# Altium schematic sheet Beacon.SchDoc
size A3; PageSetup: Record=PageOptions|CenterHorizontal=True|CenterVertical=True|PrintScale=0.97|XCorrection=1.00|YCorrection=1.00|PrintKind=0|BorderSize=5000000|LeftOffset=0|BottomOffset=0|Orientation=2|PaperLength=1000|PaperWidth=1000|Scale=100|PaperSource=7|PrintQuality=-4|MediaType=1|DitherType=10|PaperKind=A4|PrintScaleMode=1
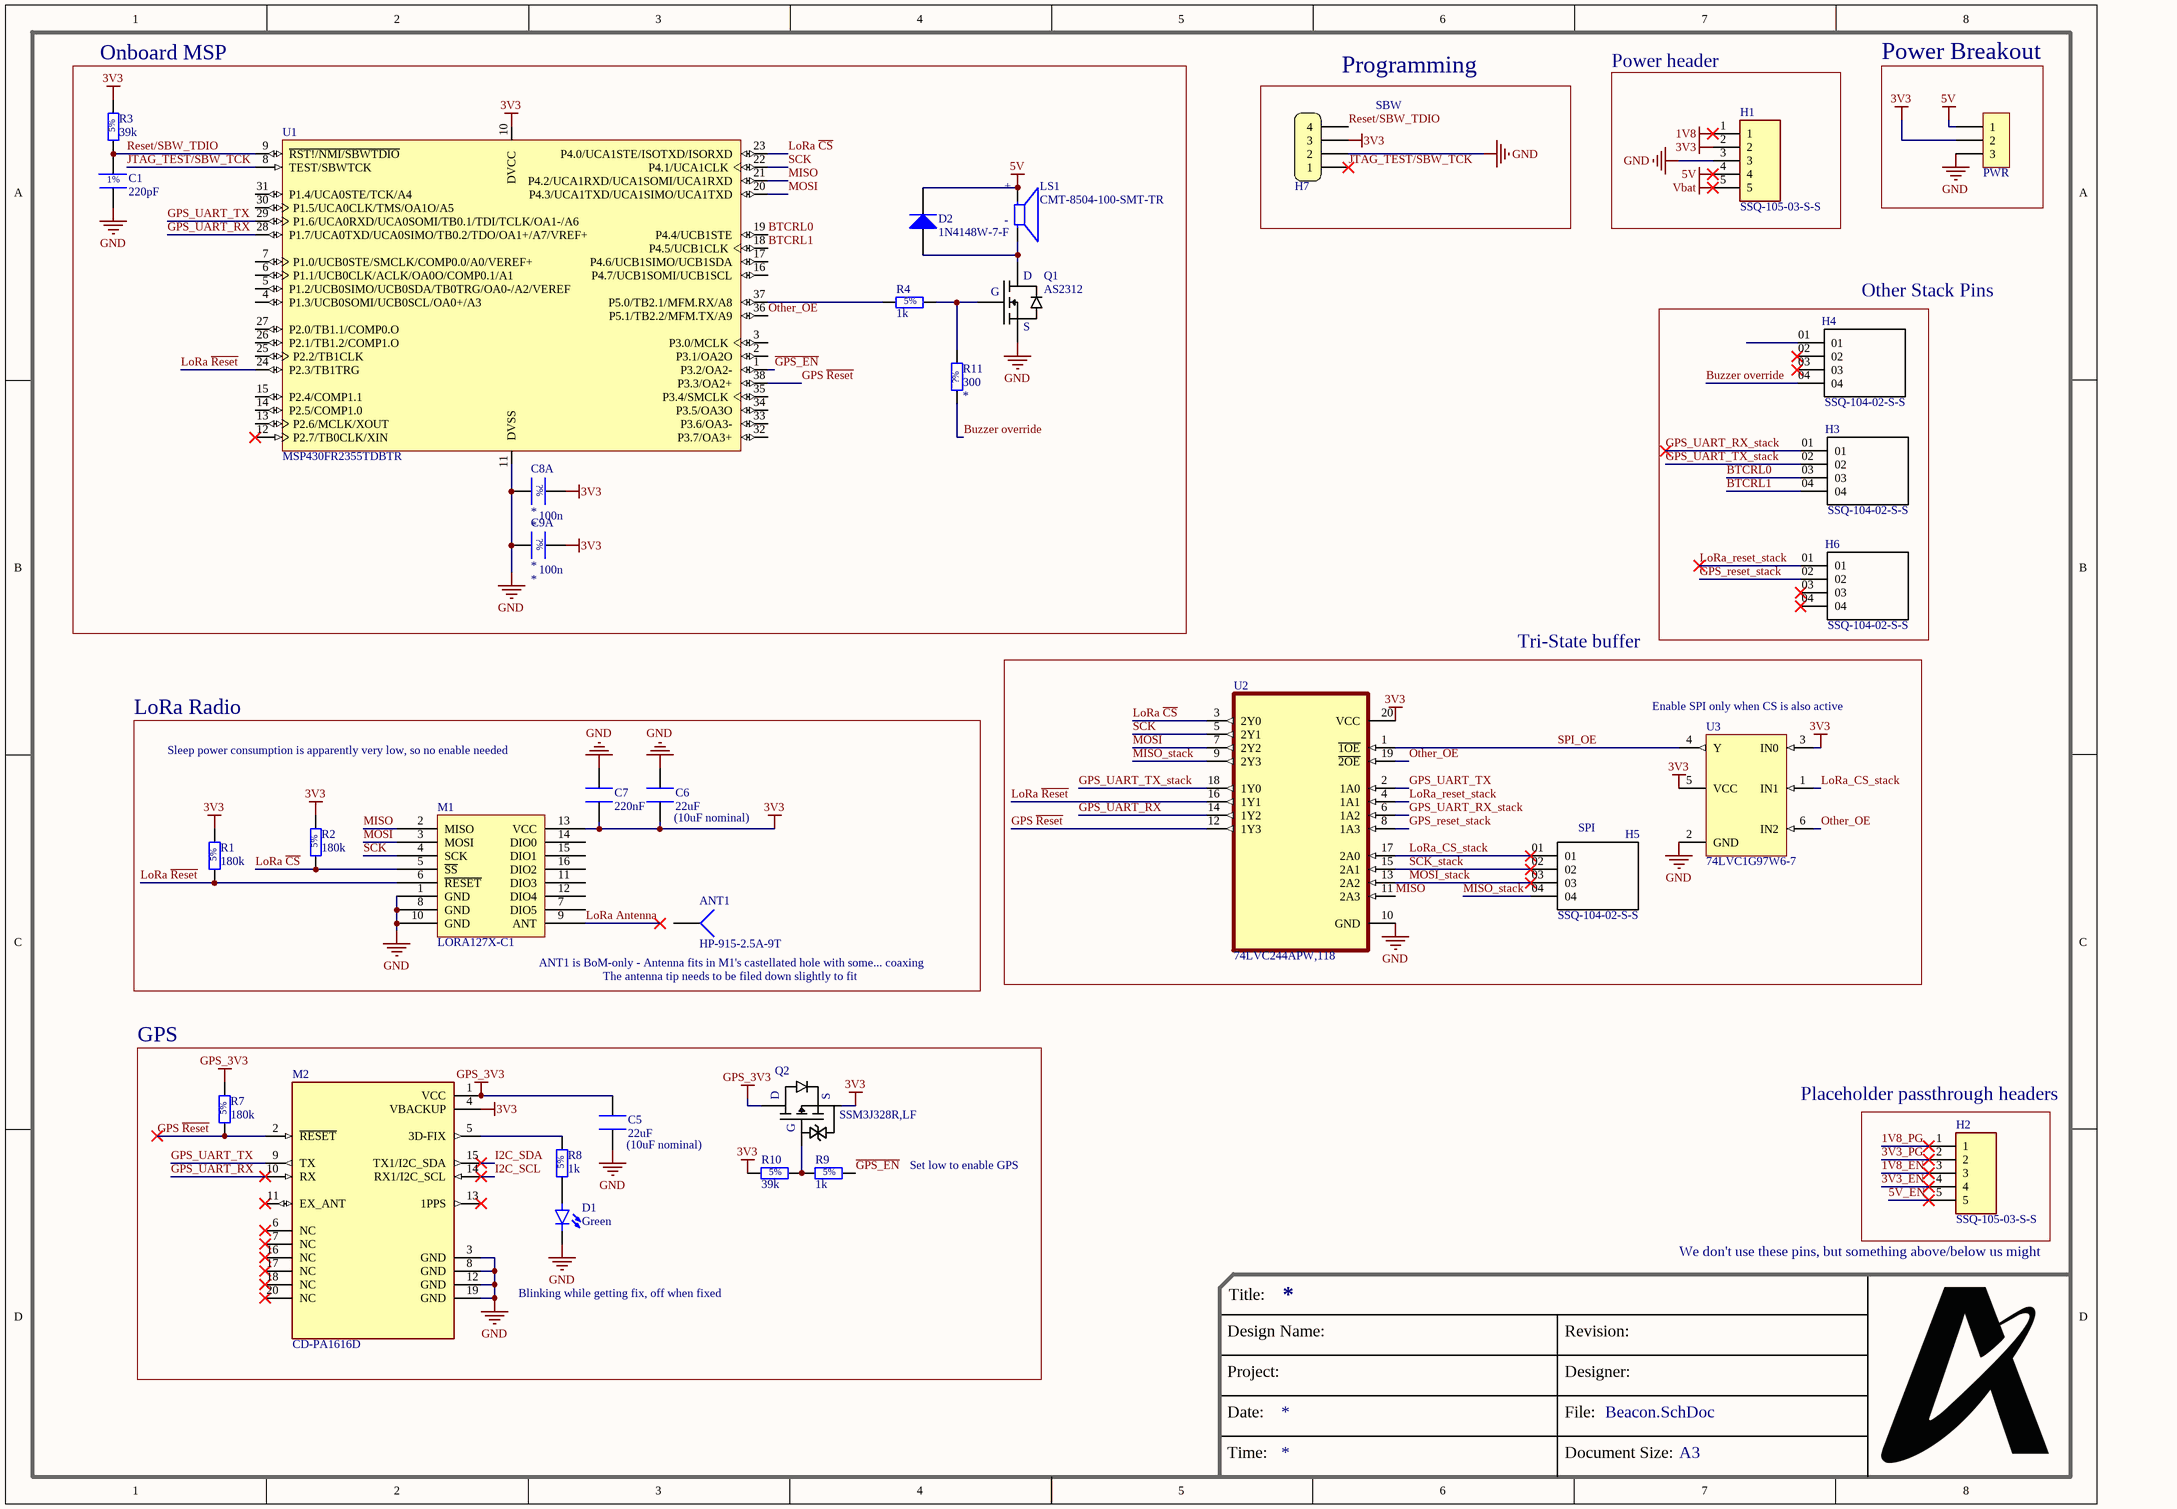
[diagram p0: Beacon.SchDoc]

## Parts
ANT1  HP-915-2.5A-9T  (mechanical)
C1  220pF  [CAPACITOR_0805_2012M-70N]
C5  22uF  [CAPACITOR_0805_2012M-70N]
C6  22uF  [CAPACITOR_0805_2012M-70N]
C7  220nF  [CAPACITOR_0805_2012M-70N]
C8  100n  [CAPACITOR_0805_2012M-70N]  (part A of 2)
C9  100n  [CAPACITOR_0805_2012M-70N]  (part A of 2)
D1  Colour: Green  [LED_0603_1608M_0.80mm]  (hidden comment: LTST-C190 Series)
D2  1N4148W-7-F  [SOD123]
H1  SSQ-105-03-S-S  [SAMTEC_SSQ-105-03-S-S]  (no BOM)
H2  SSQ-105-03-S-S  [SAMTEC_SSQ-105-03-S-S]  (no BOM)
H3  SSQ-104-02-S-S  [*SAMTEC_SSQ-104-02-S-S_SSQ-104-02-S-S(Primary)]  (no BOM)
H4  SSQ-104-02-S-S  [*SAMTEC_SSQ-104-02-S-S_SSQ-104-02-S-S(Primary)]  (no BOM)
H5  SSQ-104-02-S-S  [*SAMTEC_SSQ-104-02-S-S_SSQ-104-02-S-S(Primary)]  (no BOM)
H6  SSQ-104-02-S-S  [*SAMTEC_SSQ-104-02-S-S_SSQ-104-02-S-S(Primary)]  (no BOM)
H7  Headerless Pogo Holes 4-pin  [POGO_4_PIN_HEADER]  (value not drawn)  (no BOM)
LS1  CMT-8504-100-SMT-TR  [XDCR_CMT-8504-100-SMT-TR]
M1  LORA127X-C1  [LoRa127X-C1]
M2  CD-PA1616D  [XCVR_CD-PA1616D]
PWR  HDR,2.54mm,1x3  [HEADER_2.54MM_1x3PIN]  (value not drawn)  (no BOM)
Q1  AS2312  [SOT23-3N-1.15mm]
Q2  SSM3J328R,LF  [SOT23F-3-0.8mm]
R1  180k  [Resistor_0805_2012M-50N]
R2  180k  [Resistor_0805_2012M-50N]
R3  39k  [Resistor_0805_2012M-50N]
R4  1k  [Resistor_0805_2012M-50N]
R7  180k  [Resistor_0805_2012M-50N]
R8  1k  [Resistor_0805_2012M-50N]
R9  1k  [Resistor_0805_2012M-50N]
R10  39k  [Resistor_0805_2012M-50N]
R11  300  [RESISTOR_0805_2012M-50N]
U1  MSP430FR2355TDBTR  [TSSOP65P640X120-0.5mm-38N]
U2  74LVC244APW,118  [SOP65P640X110-20N]
U3  74LVC1G97W6-7  [SOT23-6N-1.4mm]

## Blocks framed on the sheet
Onboard MSP: C1 C8 C9 D2 LS1 Q1 R3 R4 R11 U1
Power header: H1
Power Breakout: PWR
Programming: H7
Other Stack Pins: H3 H4 H6
Tri-State buffer: H5 U2 U3
LoRa Radio: ANT1 C6 C7 M1 R1 R2
GPS: C5 D1 M2 Q2 R7-R10

## Nets
1V8: H1.1
3V3: C6.1 C7.1 C8.2 C9.2 H1.2 H7.3 M1.13(VCC) M2.4(VBACKUP) PWR.2 Q2.2(S) R1.2 R2.2 R3.2 R10.1 U1.10(DVCC) U2.20(VCC) U3.3(IN0) U3.5(VCC)
5V: D2.2(K) H1.4 LS1.P PWR.1
GND: C1.1 C5.1 C6.2 C7.2 C8.1 C9.1 D1.C H1.3 H7.2 M1.1(GND) M1.8(GND) M1.10(GND) M2.3(GND) M2.8(GND) M2.12(GND) M2.19(GND) PWR.3 Q1.2(S) U1.11(DVSS) U2.10(GND) U3.2(GND)
GPS_3V3: C5.2 M2.1(VCC) Q2.3(D) R7.2
Vbat: H1.5
1V8_EN: H2.3
1V8_PG: H2.1
3V3_EN: H2.4
3V3_PG: H2.2
5V_EN: H2.5
BTCRL0: H3.03 U1.19(P4.4/UCB1STE)
BTCRL1: H3.04 U1.18(P4.5/UCB1CLK)
Buzzer override: H4.04 R11.1
~{GPS_EN}: R9.2 U1.1(P3.2/OA2-)
GPS ~{Reset}: M2.2(~{RESET}) R7.1 U1.38(P3.3/OA2+) U2.12(1Y3)
GPS_reset_stack: H6.02 U2.8(1A3)
GPS_UART_RX: M2.10(RX) U1.28(P1.7/UCA0TXD/UCA0SIMO/TB0.2/TDO/OA1+/A7/VREF+) U2.14(1Y2)
GPS_UART_RX_stack: H3.01 U2.6(1A2)
GPS_UART_TX: M2.9(TX) U1.29(P1.6/UCA0RXD/UCA0SOMI/TB0.1/TDI/TCLK/OA1-/A6) U2.2(1A0)
GPS_UART_TX_stack: H3.02 U2.18(1Y0)
I2C_SCL: M2.14(RX1/I2C_SCL)
I2C_SDA: M2.15(TX1/I2C_SDA)
JTAG_TEST/SBW_TCK: H7.1 U1.8(TEST/SBWTCK)
LoRa Antenna: M1.9(ANT)
LoRa ~{CS}: M1.5(~{SS}) R2.1 U1.23(P4.0/UCA1STE/ISOTXD/ISORXD) U2.3(2Y0)
LoRa ~{Reset}: M1.6(~{RESET}) R1.1 U1.24(P2.3/TB1TRG) U2.16(1Y1)
LoRa_CS_stack: H5.01 U2.17(2A0) U3.1(IN1)
LoRa_reset_stack: H6.01 U2.4(1A1)
MISO: M1.2(MISO) U1.21(P4.2/UCA1RXD/UCA1SOMI/UCA1RXD) U2.11(2A3)
MISO_stack: H5.04 U2.9(2Y3)
MOSI: M1.3(MOSI) U1.20(P4.3/UCA1TXD/UCA1SIMO/UCA1TXD) U2.7(2Y2)
MOSI_stack: H5.03 U2.13(2A2)
Other_OE: U1.36(P5.1/TB2.2/MFM.TX/A9) U2.19(~{2OE}) U3.6(IN2)
Reset/SBW_TDIO: C1.2 H7.4 R3.1 U1.9(~{RST!/NMI/SBWTDIO})
SCK: M1.4(SCK) U1.22(P4.1/UCA1CLK) U2.5(2Y1)
SCK_stack: H5.02 U2.15(2A1)
SPI_OE: U2.1(~{1OE}) U3.4(Y)
NetD1_A: D1.A R8.1
NetD2_1: D2.1(A) LS1.N Q1.3(D)
NetM2_5: M2.5(3D-FIX) R8.2
NetQ1_1: Q1.1(G) R4.2 R11.2
NetQ2_1: Q2.1(G) R9.1 R10.2
NetR4_1: R4.1 U1.37(P5.0/TB2.1/MFM.RX/A8)

Not connected (* = marked no-connect by the designer): ANT1 1; H4 01 02* 03*; H6 03* 04*; M1 7(DIO5) 11(DIO3) 12(DIO4) 14(DIO0) 15(DIO1) 16(DIO2); M2 6(NC)* 7(NC)* 11(EX_ANT)* 13(1PPS)* 16(NC)* 17(NC)* 18(NC)* 20(NC)*; U1 2(P3.1/OA2O) 3(P3.0/MCLK) 4(P1.3/UCB0SOMI/UCB0SCL/OA0+/A3) 5(P1.2/UCB0SIMO/UCB0SDA/TB0TRG/OA0-/A2/VEREF) 6(P1.1/UCB0CLK/ACLK/OA0O/COMP0.1/A1) 7(P1.0/UCB0STE/SMCLK/COMP0.0/A0/VEREF+) 12(P2.7/TB0CLK/XIN)* 13(P2.6/MCLK/XOUT) 14(P2.5/COMP1.0) 15(P2.4/COMP1.1) 16(P4.7/UCB1SOMI/UCB1SCL) 17(P4.6/UCB1SIMO/UCB1SDA) 25(P2.2/TB1CLK) 26(P2.1/TB1.2/COMP1.O) 27(P2.0/TB1.1/COMP0.O) 30(P1.5/UCA0CLK/TMS/OA1O/A5) 31(P1.4/UCA0STE/TCK/A4) 32(P3.7/OA3+) 33(P3.6/OA3-) 34(P3.5/OA3O) 35(P3.4/SMCLK)

## Notes on the sheet
- SBW
- (near U3) Enable SPI only when CS is also active
- (near C7) Sleep power consumption is apparently very low, so no enable needed
- (near C6) (10uF nominal)
- (near H5) SPI
- ANT1 is BoM-only - Antenna fits in M1's castellated hole with some... coaxing
- The antenna tip needs to be filed down slightly to fit
- (near H2) Placeholder passthrough headers
- (near C5) (10uF nominal)
- Set low to enable GPS
- (near H2) We don't use these pins, but something above/below us might
- Blinking while getting fix, off when fixed
- Title:
- Design Name:
- Project:
- Revision:
- Designer:
- Date:
- Time:
- File:
- Document Size:
- A3
- (in symbol CMT-8504-100-SMT-TR) +; -
- (in symbol GCM2165CxxxxxF Series) 1%

## Library data of the parts
ANT1 = Socket: Spring Antenna; MF Part No.: HP-915-2.5A-9T
C1 = GCM2165CxxxxxF Series: Passive - Capacitor Series, C0G, 5pF ~ 22nF, 50V, 0805 (2012 Metric), ±1%, -55°C ~ 125°C; APSS Standard Part: APSS Standard; MF Part No.: GCM2165C1H221JA16D; Capacitance at Rated Voltage: 100%; E Series: E24; Tolerance: ±1%; Temperature Coefficient: C0G; Rated Voltage: 50V; Value Range: 5pF ~ 22nF; Temp Range: -55°C ~ 125°C; Supplier 1: Digikey; Package: 0805; Value: 220pF
C5 C6 = C0805C226M9PACTU: Passive - Capacitor, X5R, 22uF Max, 6.3V, 0805 (2012 Metric), ±20%, -55°C ~ 85°C. 8.8uF @ 5V; APSS Standard Part: APSS Standard; Capacitance at Rated Voltage: 30%; Tolerance: ±20%; Temperature Coefficient: X5R; Rated Voltage: 6.3V; Temp Range: -55°C ~ 85°C; Package: 0805; Supplier 1: Digikey; Supplier 1 Part No.: 399-C0805C226M9PAC7800CT-ND; MF Part No.: C0805C226M9PACTU; Value: 22uF
C7 = C0805C224K1RAC7800: Passive - Capacitor, X7R, 220nF Max, 100V, 0805 (2012 Metric), ±10%, -55°C ~ 85°C. 200nF @ 10V, 110nF @ 50V, 55nF @ 100V; APSS Standard Part: APSS Standard; Capacitance at Rated Voltage: 25%; Tolerance: ±10%; Temperature Coefficient: X7R; Rated Voltage: 100V; Temp Range: -55°C ~ 85°C; Package: 0805; Supplier 1: Digikey; Supplier 1 Part No.: 399-C0805C224K1RAC7800CT-ND; MF Part No.: C0805C224K1RAC7800; Value: 220nF
C8 C9 = Generic Capacitor: Passive - Capacitor, Generic; Tolerance: ?%; MF Part No.: *; Value: *
D1 = LTST-C190 Series: Diode - LED, 0603; MF Part No.: LTST-C190KGKT; APSS Standard Part: APSS Standard; Temp Range: -30°C ~ 85°C; Rated Voltage: 5V Reverse; Package: 0603; Supplier 1: Digikey
D2 = 1N4148_SMT_SOD123: DIODE GEN PURP 100V 300MA SOD123; Manufacturer: Diodes Incorporated; Manufacturer Part Number: 1N4148W-13-F; Diode Type: Standard; Current - Average Rectified (Io): 150mA; Speed: Small Signal =< 200mA (Io), Any Speed; Capacitance @ Vr, F: 2pF @ 0V, 1MHz; Supplier 1: Digi-Key; RoHS: RoHS Compliant; Category: Discrete Semiconductor Products; Stock 1: 5282; Pricing 1: 1=0.33, 10=0.292, 100=0.1586, 500=0.0976, 1000=0.06656 (NZD); Packaging: Cut Tape (CT); Part Status: Active; Mounting Type: Surface Mount; Package / Case: SOD-123; Supplier Device Package: SOD-123; Operating Temperature - Junction: -65°C ~ 150°C; Base Part Number: 1N4148W; ComponentLink1URL: https://www.diodes.com/assets/Datasheets/ds30086.pdf; ComponentLink1Description: https://www.diodes.com/assets/Datasheets/ds30086.pdf; Supplier Part Number 1: 1N4148W-13FDICT-ND
LS1 = CMT-8504-100-SMT-TR: 8.5 mm, 5 Vo-p, 100 dB, Surface Mount (SMT), Magnetic Audio Transducer Buzzer; MF Part No.: CMT-8504-100-SMT-TR
M1 = LORA127X-C1: LoRa transceiver; MF Part No.: LORA127X-C1
M2 = CD-PA1616D: CD-PA1616D GNSS patch antenna module; MF Part No.: CD-PA1616D
PWR = HDR,2.54mm,1x3: Connector - 2.54mm, 1x3-pin
Q1 = AS2312: Transistor - MOSFET, N-Channel AS2312; APSS Standard Part: APSS Standard; Temp Range: 0°C ~ 150°C (TJ); Rated Voltage: 20 Vds; Power: 1.2W; Package: SOT23-3; MF Part No.: AS2312; Supplier 1: Digikey; Supplier 1 Part No.: 4530-AS2312CT-ND
Q2 = SSM3J328R,LF: Transistor - MOSFET, P-Channel SSM3J328R,LF; APSS Standard Part: APSS Standard; Temp Range: 0°C ~ 150°C (TJ); Rated Voltage: 20 Vds; Power: 1W; MF Part No.: SSM3J328R,LF; Package: SOT23-3; Supplier 1: Digikey; Supplier 1 Part No.: SSM3J328RLFCT-ND
R1 R2 R7 = RMCF0805JT Series: Passive - Resistor Series, 0805, 5%, 100m - 22M, E24, 0.063W, 1/16W, ±200ppm/°C, -55°C ~ 155°C, 0805 (2012 Metric); MF Part No.: RMCF0805JT180K; APSS Standard Part: APSS Standard; Power: 1/8W; Value Range: 100m ~ 22M; Rated Voltage: 150V; Tolerance: 5%; E Series: E24; Temp Range: -55°C ~ 155°C; Supplier 1: Digikey; Package: 0805; Temperature Coefficient: ±200ppm/°C; Value: 180k
R3 R10 = RMCF0805JT Series: Passive - Resistor Series, 0805, 5%, 100m - 22M, E24, 0.063W, 1/16W, ±200ppm/°C, -55°C ~ 155°C, 0805 (2012 Metric); MF Part No.: RMCF0805JT39K0; APSS Standard Part: APSS Standard; Power: 1/8W; Value Range: 100m ~ 22M; Rated Voltage: 150V; Tolerance: 5%; E Series: E24; Temp Range: -55°C ~ 155°C; Supplier 1: Digikey; Package: 0805; Temperature Coefficient: ±200ppm/°C; Value: 39k
R4 R8 R9 = RMCF0805JT Series: Passive - Resistor Series, 0805, 5%, 100m - 22M, E24, 0.063W, 1/16W, ±200ppm/°C, -55°C ~ 155°C, 0805 (2012 Metric); MF Part No.: RMCF0805JT1K00; APSS Standard Part: APSS Standard; Power: 1/8W; Value Range: 100m ~ 22M; Rated Voltage: 150V; Tolerance: 5%; E Series: E24; Temp Range: -55°C ~ 155°C; Supplier 1: Digikey; Package: 0805; Temperature Coefficient: ±200ppm/°C; Value: 1k
R11 = Generic Resistor: Passive - Resistor, Generic; Tolerance: ?%; MF Part No.: *; Value: 300
U1 = MSP430FR2355TDBTR: IC - Microcontroller, TSSOP-38, 24MHz, 32KB FRAM, Op-Amps/PGAs, 12-bit DACs, 12-bit ADC, -40 to 105C; MF Part No.: MSP430FR2355TPT; APSS Standard Part: APSS Standard; Temp Range: -40°C ~ 105°C; Rated Voltage: 3.6V; Package: LQFP-48; Supplier 1: Digikey; Supplier 1 Part No.: 296-50260-ND
U2 = 74LVC244APW,118: Octal buffer/line driver; MP: 74LVC244APW-118; Package: None; Price: None; Value: *; Availability: Unavailable
U3 = 74LVC1G97W6-7: IC - Multifunction Logic Gate, 1 Circuit, 3 Input, 1.65 - 5.5V, AND, OR, NOT, MUX, SOT-23-6; APSS Standard Part: APSS Standard; Temp Range: -40°C ~ 125°C; Package: SOT-23-6; Rated Voltage: 5.5V; Supplier 1: Digikey; Supplier 1 Part No.: 74LVC1G97W6-7; MF Part No.: 74LVC1G97W6-7
H1 H2 = SSQ-105-03-S-S: MF Part No.: SSQ-105-03-S-S